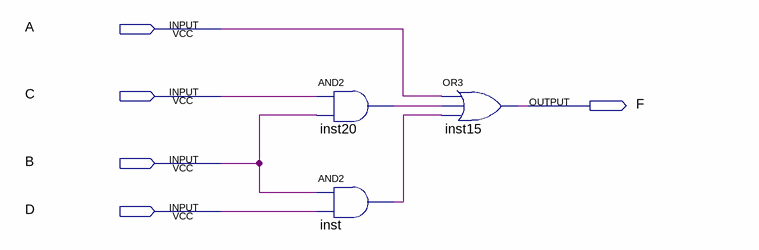
[diagram p0: schematic sheet]
// Quartus schematic block1.bdf as structural Verilog: 3 symbols, 5 pins
module block1 (
  input  A,
  input  C,
  input  B,
  input  D,
  output F
);

  wire inst20_out, inst_out;

  and inst20 (inst20_out, C, B);
  and inst (inst_out, B, D);
  or inst15 (F, A, inst20_out, inst_out);
endmodule
